# EAGLE design MFOS Dual VCA 2Layer (EAGLE 7.6.0)
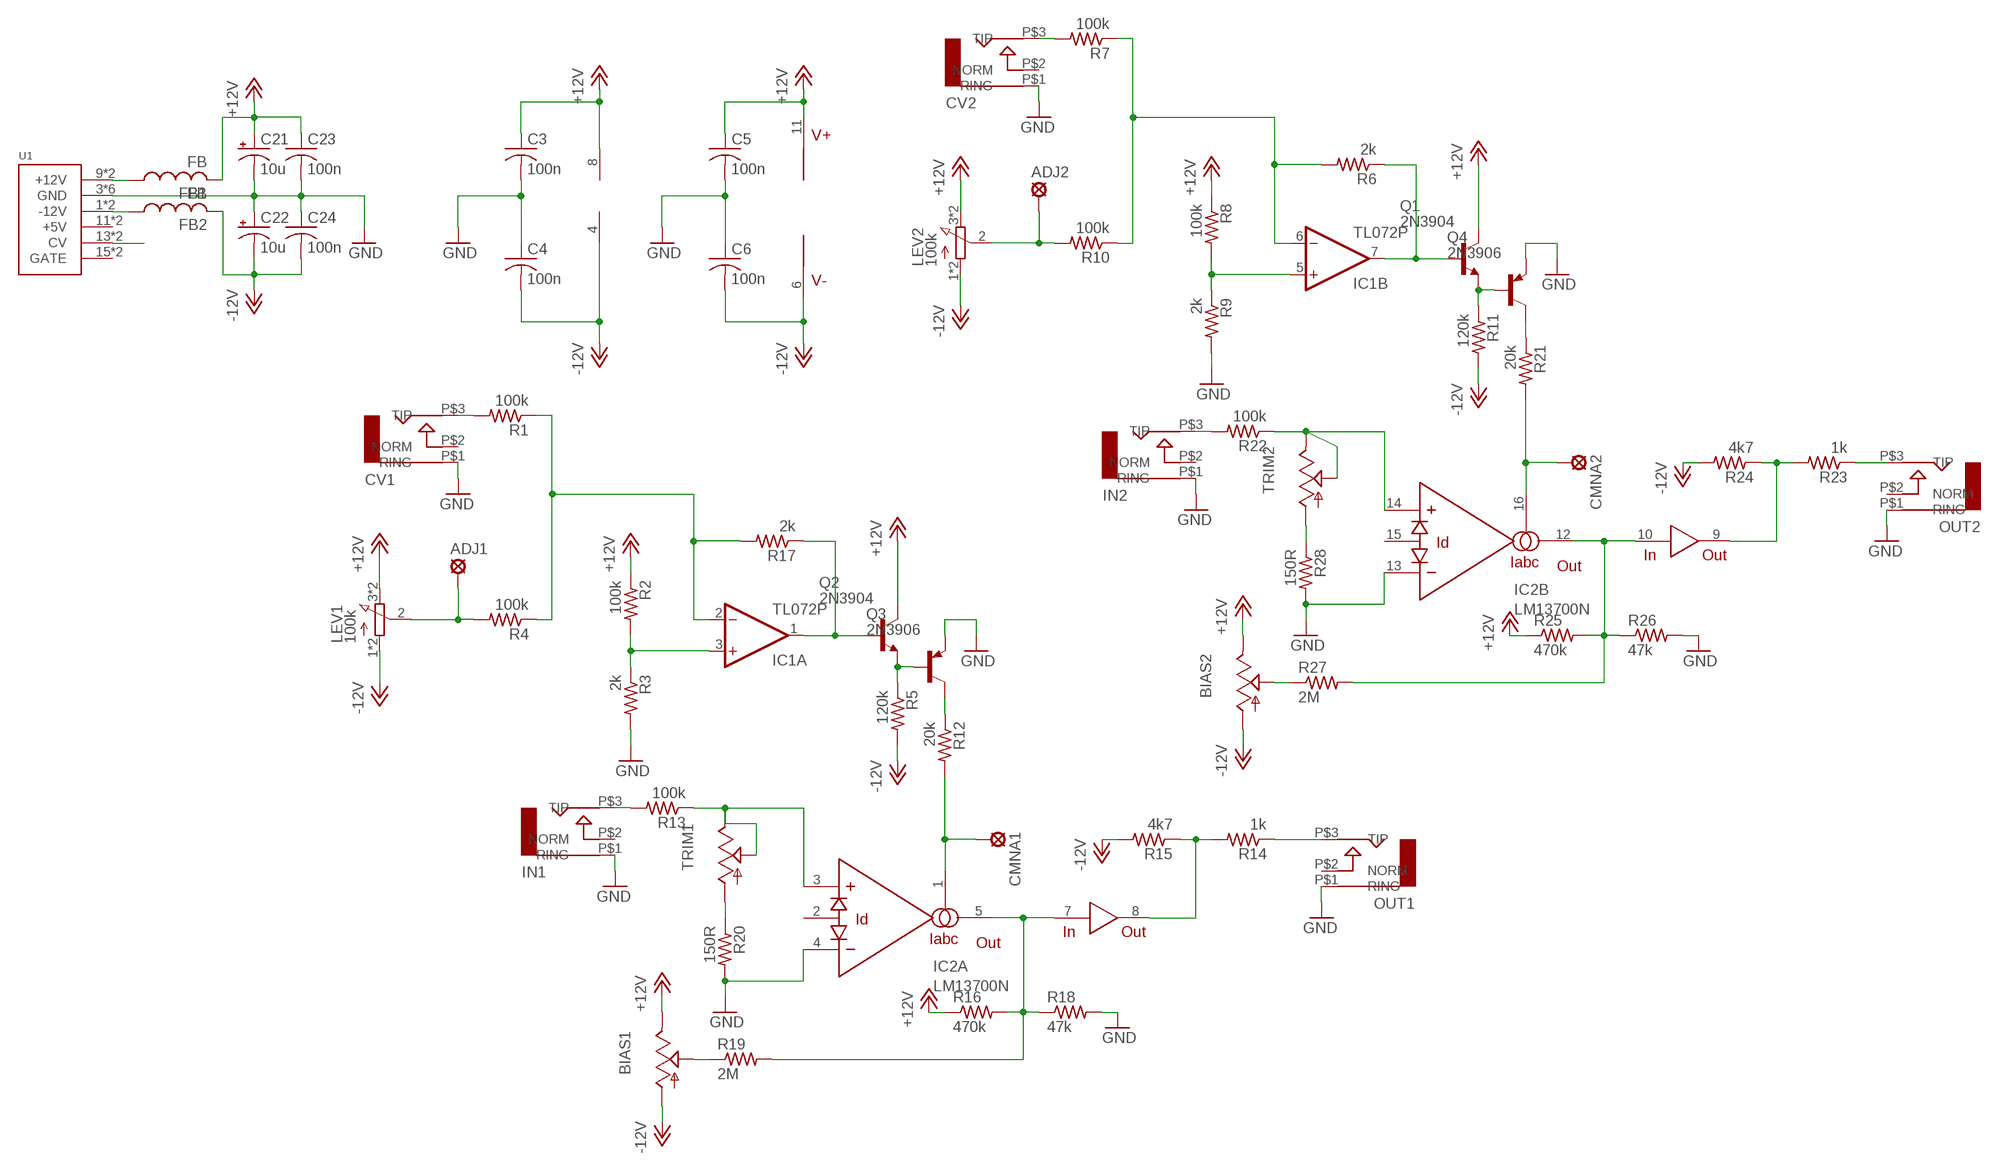
[diagram p0: schematic, sheet 1]

## Parts
ADJ1  LSP10  [LSP10]
ADJ2  LSP10  [LSP10]
BIAS1  TRIM_US-B64W  [B64W]
BIAS2  TRIM_US-B64W  [B64W]
C3  100n  C-USC1206  [C1206]
C4  100n  C-USC1206  [C1206]
C5  100n  C-USC1206  [C1206]
C6  100n  C-USC1206  [C1206]
C21  10u  CPOL-USB45181A  [B45181A]
C22  10u  CPOL-USB45181A  [B45181A]
C23  100n  C-US050-024X044  [C050-024X044]
C24  100n  C-US050-024X044  [C050-024X044]
CMNA1  LSP10  [LSP10]
CMNA2  LSP10  [LSP10]
CV1  AUDIO-JACKITEAD  [JACK-90DEG-ITEAD]
CV2  AUDIO-JACKITEAD  [JACK-90DEG-ITEAD]
FB1  FB  [FB]
FB2  FB  [FB]
IC1  TL072P  [DIL08]
IC2  LM13700N  [DIL16]
IN1  AUDIO-JACKITEAD  [JACK-90DEG-ITEAD]
IN2  AUDIO-JACKITEAD  [JACK-90DEG-ITEAD]
LEV1  100k  3RP/1610N  [3RP/1610N]
LEV2  100k  3RP/1610N  [3RP/1610N]
OUT1  AUDIO-JACKITEAD  [JACK-90DEG-ITEAD]
OUT2  AUDIO-JACKITEAD  [JACK-90DEG-ITEAD]
Q1  2N3904  [TO92]
Q2  2N3904  [TO92]
Q3  2N3906  [TO92]
Q4  2N3906  [TO92]
R1  100k  R-US_0207/7  [0207/7]
R2  100k  R-US_0207/7  [0207/7]
R3  2k  R-US_0207/7  [0207/7]
R4  100k  R-US_0207/7  [0207/7]
R5  120k  R-US_0207/7  [0207/7]
R6  2k  R-US_0207/7  [0207/7]
R7  100k  R-US_0207/7  [0207/7]
R8  100k  R-US_0207/7  [0207/7]
R9  2k  R-US_0207/7  [0207/7]
R10  100k  R-US_0207/7  [0207/7]
R11  120k  R-US_0207/7  [0207/7]
R12  20k  R-US_0207/7  [0207/7]
R13  100k  R-US_0207/7  [0207/7]
R14  1k  R-US_0207/7  [0207/7]
R15  4k7  R-US_0207/7  [0207/7]
R16  470k  R-US_0207/7  [0207/7]
R17  2k  R-US_0207/7  [0207/7]
R18  47k  R-US_0207/7  [0207/7]
R19  2M  R-US_0207/7  [0207/7]
R20  150R  R-US_0207/7  [0207/7]
R21  20k  R-US_0207/7  [0207/7]
R22  100k  R-US_0207/7  [0207/7]
R23  1k  R-US_0207/7  [0207/7]
R24  4k7  R-US_0207/7  [0207/7]
R25  470k  R-US_0207/7  [0207/7]
R26  47k  R-US_0207/7  [0207/7]
R27  2M  R-US_0207/7  [0207/7]
R28  150R  R-US_0207/7  [0207/7]
TRIM1  TRIM_US-B64W  [B64W]
TRIM2  TRIM_US-B64W  [B64W]
U1  POWER  [POWER_16]

## Nets
+12V: BIAS1.E BIAS2.E C3.1 C5.1 C21.+ C23.1 FB1.P$2 IC1.8(P:V+) IC2.11(V+) LEV1.3(E) LEV1.6(E) LEV2.3(E) LEV2.6(E) Q1.1(C) Q2.1(C) R2.1 R8.1 R16.1 R25.1
-12V: BIAS1.A BIAS2.A C4.2 C6.2 C22.- C24.2 FB2.P$2 IC1.4(P:V-) IC2.6(V-) LEV1.1(A) LEV1.4(A) LEV2.1(A) LEV2.4(A) R5.2 R11.2 R15.2 R24.2
GND: C3.2 C4.1 C5.2 C6.1 C21.- C22.+ C23.2 C24.1 CV1.P$1(RING) CV2.P$1(RING) IC2.4(A:-IN) IC2.13(B:-IN) IN1.P$1(RING) IN2.P$1(RING) OUT1.P$1(RING) OUT2.P$1(RING) Q3.3(E) Q4.3(E) R3.2 R9.2 R18.2 R20.2 R26.2 R28.2 U1.3(GND) U1.4(GND) U1.5(GND) U1.6(GND) U1.7(GND) U1.8(GND)
N$1: IC1.7(B:OUT) Q1.2(B) R6.1
N$2: IC1.5(B:+IN) R8.2 R9.1
N$3: CV1.P$3(TIP) R1.2
N$4: CV2.P$3(TIP) R7.2
N$5: ADJ1.MP LEV1.2(S) R4.2
N$6: IC1.2(A:-IN) R1.1 R4.1 R17.2
N$7: Q2.3(E) Q3.2(B) R5.1
N$8: IC1.1(A:OUT) Q2.2(B) R17.1
N$9: ADJ2.MP LEV2.2(S) R10.2
N$10: IC1.6(B:-IN) R6.2 R7.1 R10.1
N$11: IC1.3(A:+IN) R2.2 R3.1
N$12: Q3.1(C) R12.1
N$13: IN1.P$3(TIP) R13.2
N$14: Q1.3(E) Q4.2(B) R11.1
N$15: Q4.1(C) R21.1
N$16: CMNA1.MP IC2.1(A:IABC) R12.2
N$17: IN2.P$3(TIP) R22.2
N$18: BIAS1.P$1(S) BIAS1.S R19.1
N$19: OUT1.P$3(TIP) R14.1
N$20: IC2.8(OUT) R14.2 R15.1
N$21: IC2.5(A:OUT) IC2.7(IN) R16.2 R18.1 R19.2
N$22: R20.1 TRIM1.A
N$23: IC2.3(A:+IN) R13.1 TRIM1.E TRIM1.P$1(S) TRIM1.S
N$24: CMNA2.MP IC2.16(B:IABC) R21.2
N$25: IC2.9(OUT) R23.2 R24.1
N$26: OUT2.P$3(TIP) R23.1
N$27: IC2.10(IN) IC2.12(B:OUT) R25.2 R26.1 R27.2
N$28: BIAS2.P$1(S) BIAS2.S R27.1
N$29: R28.1 TRIM2.A
N$30: IC2.14(B:+IN) R22.1 TRIM2.E TRIM2.P$1(S) TRIM2.S
N$55: U1.13(CV) U1.14(CV)
N$61: FB1.P$1 U1.9(+12V) U1.10(+12V)
N$62: FB2.P$1 U1.1(-12V) U1.2(-12V)
Unconnected: CV1.P$2(NORM) CV2.P$2(NORM) IC2.2(A:ID) IC2.15(B:ID) IN1.P$2(NORM) IN2.P$2(NORM) OUT1.P$2(NORM) OUT2.P$2(NORM) U1.11(+5V) U1.12(+5V) U1.15(GATE) U1.16(GATE)

## Library data of the parts
ADJ1 ADJ2 CMNA1 CMNA2 = solpad:LSP10: SOLDER PAD drill 1.0 mm, distributor Buerklin, 12H555
BIAS1 BIAS2 TRIM1 TRIM2 = pot:TRIM_US-: POTENTIOMETER
C3-C6 C23 C24 = rcl:C-US: CAPACITOR, American symbol
C21 C22 = rcl:CPOL-US: POLARIZED CAPACITOR, American symbol
CV1 CV2 IN1 IN2 OUT1 OUT2 = erthenvar:AUDIO-JACK: Switching Mono 3.5mm Audio Jack from Erthenvar.
FB1 FB2 = adafruit:FB: Ferrite bead Digikey #P9821BK-ND
IC1 = linear:TL072: OP AMP
IC2 = synthdiy updated imperial:LM13700: National Dual OTA with buffers.
LEV1 LEV2 = pot:3RP/1610N: 16mm Potentiometer one level Source: http://www.alphapotentiometers.net/html/16mm_pot_2.html
Q1 Q2 = transistor-npn:2N3904: NPN Transistor
Q3 Q4 = transistor-pnp:2N3906: PNP Transistor
R1-R28 = rcl:R-US_: RESISTOR, American symbol
U1 = eurorack:POWER

## Board
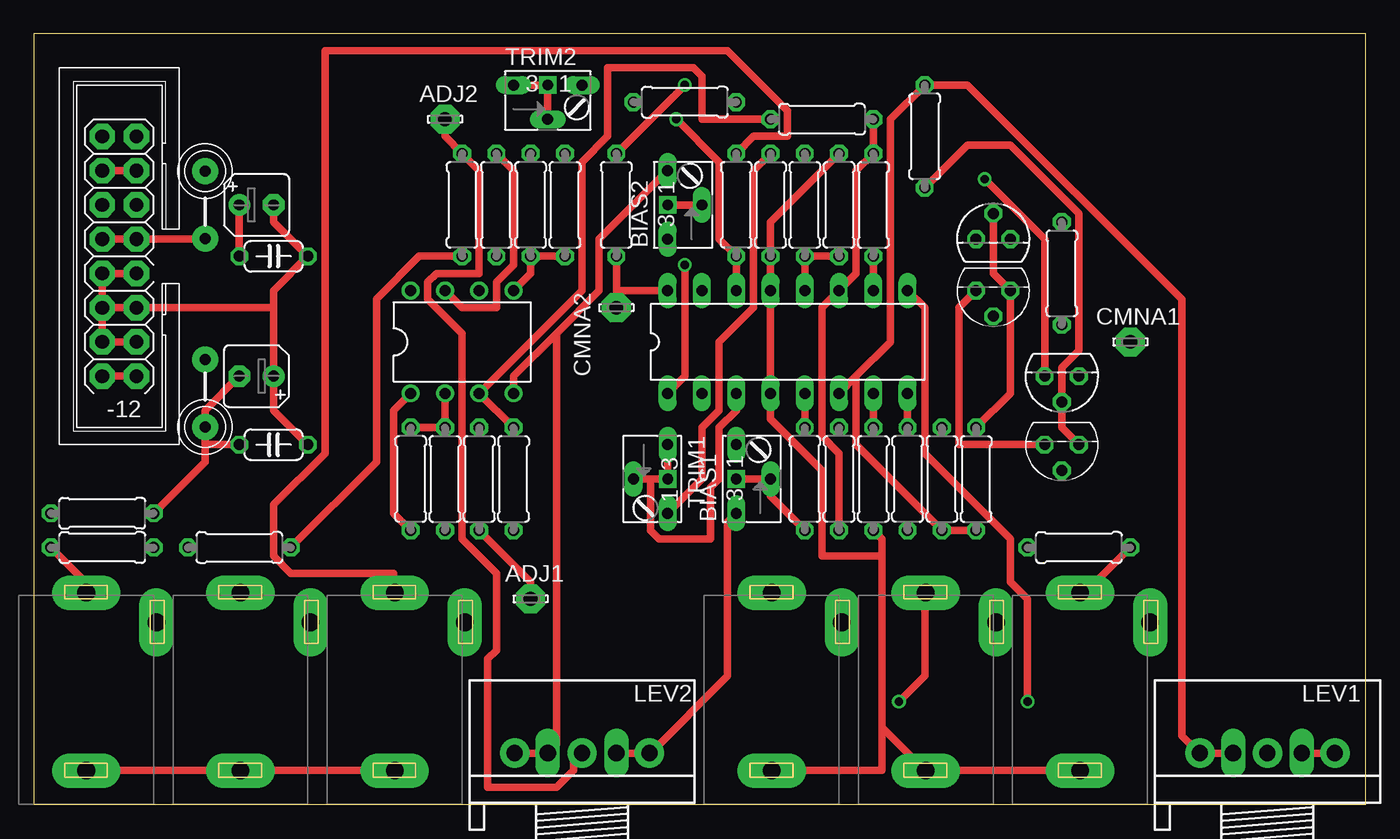
[diagram p1: board, top side]
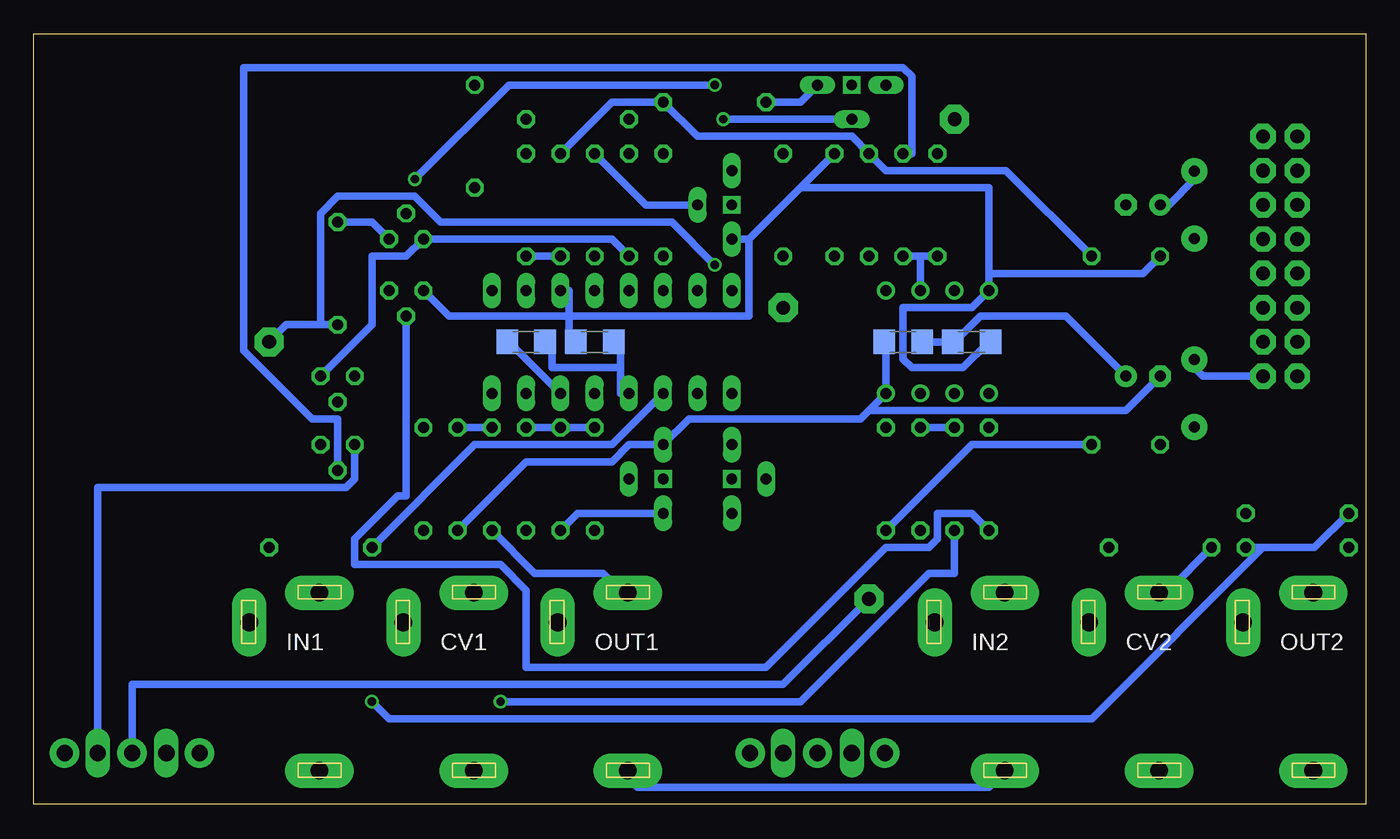
[diagram p2: board, bottom side, seen from below]

Size 98.73 x 57.14 mm. Coordinates in mm from the lower left corner, seen from the top.
Outline: 0,0 98.73,0 98.73,57.14 0,57.14 0,0
Copper layers (1*16): Top 0.035mm / dielectric 1.5mm / Bottom 0.035mm
Design rules "default *": minimum track width 22mil, minimum drill 24mil, track to track 12mil, track to pad 12mil, pad to pad 12mil, via to via 12mil, smd to smd 12mil, copper to edge 0mil, drill to drill 12mil, minimum pad ring 10mil, minimum via ring 8mil, stop-mask expansion 4mil, vias tented up to drill 0mil, thermal gap 10mil

### Footprints (pad centres in the part's own frame; a part is rotated, then mirrored left to right if it is on the bottom)
LSP10 = drill 1.016 pad 2.159 octagon: MP 0,0
B64W = drill 0.813 long: A 2.54,0; E -2.54,0; S 0,-2.54 | drill 0.8 square: P$1 0,0
C1206 = smd 1.6 x 1.8: 1 -1.4,0; 2 1.4,0
B45181A = drill 0.813 pad 1.6: + -1.27,0 | drill 0.813 pad 1.6 octagon: - 1.27,0
C050-024X044 = drill 0.813 octagon: 1 -2.54,0; 2 2.54,0
JACK-90DEG-ITEAD = drill 1.3 pad 2.54 long: P$1 5,-2.5; P$2 -0.2,-13.5; P$3 5,-15.7
FB = drill 0.8 pad 1.93: P$1 -2.5,0; P$2 2.5,0
DIL08 = drill 0.813 pad 1.27: 1 -3.81,-3.81; 2 -1.27,-3.81; 3 1.27,-3.81; 4 3.81,-3.81; 5 3.81,3.81; 6 1.27,3.81; 7 -1.27,3.81; 8 -3.81,3.81
DIL16 = drill 0.813 long: 1 -8.89,-3.81; 2 -6.35,-3.81; 3 -3.81,-3.81; 4 -1.27,-3.81; 5 1.27,-3.81; 6 3.81,-3.81; 7 6.35,-3.81; 8 8.89,-3.81; 9 8.89,3.81; 10 6.35,3.81; 11 3.81,3.81; 12 1.27,3.81; 13 -1.27,3.81; 14 -3.81,3.81; 15 -6.35,3.81; 16 -8.89,3.81
3RP/1610N = drill 1.2 pad 2.184: 1 -5,0; 2 0,0; 3 5,0 | drill 1.2 long: 4 -2.54,0; 6 2.54,0
TO92 = drill 0.813 octagon: 1 1.27,0; 2 0,1.905; 3 -1.27,0
0207/7 = drill 0.813 octagon: 1 -3.81,0; 2 3.81,0
POWER_16 = drill 1.016 pad 1.88 octagon: 1 -6.35,-1.27; 2 -6.35,1.27; 3 -3.81,-1.27; 4 -3.81,1.27; 5 -1.27,-1.27; 6 -1.27,1.27; 7 1.27,-1.27; 8 1.27,1.27; 9 3.81,-1.27; 10 3.81,1.27; 11 6.35,-1.27; 12 6.35,1.27; 13 8.89,-1.27; 14 8.89,1.27; 15 11.43,-1.27; 16 11.43,1.27

### Placement (x,y rotation side)
ADJ1  36.83,15.24 0 top
ADJ2  30.48,50.8 0 top
BIAS1  52.07,24.13 90 top
BIAS2  46.99,44.45 90 top
C3  29.21,34.29 180 bottom
C4  34.29,34.29 180 bottom
C5  57.15,34.29 0 bottom
C6  62.23,34.29 180 bottom
C21  16.51,44.45 0 top
C22  16.51,31.75 180 top
C23  17.78,40.64 0 top
C24  17.78,26.67 180 top
CMNA1  81.28,34.29 0 top
CMNA2  43.18,36.83 0 top
CV1  71.12,0 180 top
CV2  20.32,0 180 top
FB1  12.7,44.45 90 top
FB2  12.7,30.48 270 top
IC1  31.75,34.29 0 top
IC2  55.88,34.29 0 top
IN1  82.55,0 180 top
IN2  31.75,0 180 top
LEV1  91.44,3.81 0 top
LEV2  40.64,3.81 0 top
OUT1  59.69,0 180 top
OUT2  8.89,0 180 top
Q1  76.2,26.67 180 top
Q2  71.12,38.1 180 top
Q3  71.12,41.91 0 top
Q4  76.2,31.75 180 top
R1  30.48,24.13 270 top
R2  58.42,50.8 180 top
R3  35.56,24.13 270 top
R4  33.02,24.13 270 top
R5  69.85,24.13 270 top
R6  34.29,44.45 270 top
R7  15.24,19.05 180 top
R8  39.37,44.45 270 top
R9  36.83,44.45 90 top
R10  31.75,44.45 90 top
R11  66.04,49.53 90 top
R12  76.2,39.37 270 top
R13  77.47,19.05 0 top
R14  64.77,24.13 90 top
R15  67.31,24.13 270 top
R16  59.69,24.13 90 top
R17  27.94,24.13 90 top
R18  62.23,24.13 270 top
R19  57.15,24.13 90 top
R20  54.61,44.45 270 top
R21  43.18,44.45 270 top
R22  52.07,44.45 90 top
R23  5.08,19.05 0 top
R24  5.08,21.59 0 top
R25  62.23,44.45 270 top
R26  59.69,44.45 90 top
R27  57.15,44.45 270 top
R28  48.26,52.07 0 top
TRIM1  46.99,24.13 270 top
TRIM2  38.1,53.34 0 top
U1  6.35,38.1 90 top

### Tracks (layer width: path | path; a pad name or v marks a point on that pad's centre or on a via)
+12V
  Top 0.559: C21.+ C23.1 | LEV2.6 LEV2.3 45.72,3.81 51.44,9.53 51.44,20.95 BIAS1.E | LEV1.3 LEV1.6 | R2.1 R25.1 60.96,46.99 60.96,39.37 IC2.11 58.42,36.83 58.42,27.3 59.69,26.04 R16.1 | Q1.1 68.58,26.67 68.58,36.83 Q2.1
  Bottom 0.559: C21.+ 14.61,44.45 12.7,46.35 FB1.P$2 | C3.1 27.94,34.29 29.84,32.38 33.66,32.38 34.29,33.02 34.29,36.83 29.21,36.83 IC1.8 27.94,39.37 | 45.72,41.91 41.91,45.72 | 41.91,45.72 R8.1 | BIAS2.E 45.72,41.91 | 27.94,39.37 27.94,45.72 41.91,45.72 | C23.1 16.51,39.37 27.94,39.37 | BIAS1.E 58.42,21.59 R16.1 | 59.05,36.2 59.05,38.1 IC2.11 | 59.05,36.2 59.05,34.29 C5.1 | Q2.1 67.94,36.2 59.05,36.2 | LEV1.6 93.98,23.5 75.56,23.5 74.93,24.13 Q1.1 | 45.72,41.91 45.72,36.2 59.05,36.2
-12V
  Top 0.559: LEV1.4 LEV1.1 86.36,3.81 85.09,5.08 85.09,37.47 69.22,53.34 R11.2 63.5,50.8 63.5,34.29 60.96,31.75 | R5.2 R15.2 60.96,26.67 60.96,31.75 | IC2.6 60.96,31.75 | R24.2 12.7,25.4 12.7,26.67 | 12.7,26.67 FB2.P$2 12.7,29.21 C22.- | 12.7,26.67 C24.2 | LEV2.1 LEV2.4 38.73,4.45 38.73,34.92 | BIAS2.A 41.91,41.91 41.91,38.1 38.73,34.92 | 38.73,34.92 35.56,31.75 IC1.4
  Bottom 0.559: IC2.6 63.5,34.29 C6.2 | C4.2 35.56,34.29 IC1.4 36.83,29.21 | 36.83,29.21 37.47,28.57 50.16,28.57 BIAS1.A 54.61,26.67 55.88,25.4 62.23,25.4 R15.2 | C22.- 17.78,29.21 36.83,29.21
GND
  Top 0.559: OUT2.P$1 4.45,2.54 15.24,2.54 CV2.P$1 15.88,2.54 26.67,2.54 IN2.P$1 | R18.2 62.87,19.68 62.87,18.41 | 62.87,5.71 62.87,18.41 | 62.87,5.71 66.04,2.54 CV1.P$1 66.67,2.54 77.47,2.54 IN1.P$1 | 62.87,5.71 62.87,2.54 55.24,2.54 OUT1.P$1 | U1.7 U1.8 U1.6 | U1.6 U1.4 U1.3 | U1.6 U1.5 17.78,36.83 | C21.- 17.78,43.18 C23.2 17.78,38.1 17.78,36.83 | C24.1 17.78,29.21 C22.+ 17.78,36.83 | R26.2 54.61,43.18 R20.2 IC2.13 IC2.4 54.61,28.57 58.42,24.77 58.42,18.41 62.87,18.41
  Bottom 0.559: IN2.P$1 27.3,1.91 27.94,1.27 53.98,1.27 54.61,1.91 OUT1.P$1 | C4.1 C3.2 30.48,34.29 28.57,36.2 22.23,36.2 C22.+ | R3.2 29.21,26.67 C24.1 | R26.2 55.88,52.07 R28.2 49.53,49.53 38.1,49.53 R9.2 35.56,46.99 26.67,46.99 C23.2 | 55.24,32.38 55.24,30.48 IC2.4 | 55.24,32.38 55.24,34.29 C5.2 | 55.24,32.38 60.33,32.38 60.33,34.29 C6.1 | R20.2 55.88,41.91 Q3.3 71.12,40.64 73.66,40.64 73.66,35.56 Q4.3
N$1
  Top 0.559: IC1.7 31.75,36.83 34.29,36.83 34.29,38.73 35.56,40.01 35.56,46.99 R6.1
  Bottom 0.559: Q1.2 76.2,28.57 78.11,28.57 83.19,33.66 83.19,54.61 34.29,54.61 33.66,53.98 33.66,48.26 R6.1
N$2
  Top 0.559: IC1.5 36.83,39.37 R9.1 R8.2
N$3  (via drill 0.61)
  Top 0.559: v64.14,7.62 66.04,9.53 66.04,15.24 CV1.P$3
  Bottom 0.559: R1.2 30.48,17.14 32.38,17.14 41.91,7.62 v64.14,7.62
N$4
  Bottom 0.559: R7.2 14.61,15.88 15.24,15.88 CV2.P$3
N$5
  Top 0.559: R4.2 36.83,16.51 ADJ1.MP
  Bottom 0.559: LEV1.2 91.44,8.89 43.18,8.89 ADJ1.MP
N$6
  Top 0.559: R17.2 R1.1 IC1.2
  Bottom 0.559: R1.1 R4.1
N$7
  Top 0.559: R5.1 72.39,30.48 Q2.3 71.12,39.37 Q3.2
N$8
  Top 0.559: R17.1 26.67,21.59 26.67,29.21 IC1.1
  Bottom 0.559: Q2.2 71.12,22.86 71.75,22.86 74.93,19.68 74.93,17.78 64.14,17.78 62.23,15.88 62.23,10.16 44.45,10.16 35.56,19.05 32.38,19.05 31.75,19.68 31.75,21.59 29.21,21.59 R17.1
N$9
  Top 0.559: ADJ2.MP 30.48,49.53 R10.2 33.02,46.99 33.02,39.37 29.84,39.37 29.21,38.73 29.21,37.47 31.75,34.92 31.75,19.68 34.29,17.14 34.29,11.43 33.66,10.79 33.66,1.27 38.73,1.27 40.01,2.54 40.01,3.17 LEV2.2
N$10
  Top 0.559: R7.1 25.4,25.4 25.4,37.47 28.57,40.64 R10.1
  Bottom 0.559: 33.02,40.64 IC1.6 | R10.1 33.02,40.64 | 33.02,40.64 R6.2
N$11
  Top 0.559: R3.1 IC1.3 40.64,38.1 40.64,47.62 42.55,49.53 42.55,54.61 48.9,54.61 49.53,53.98 49.53,50.8 R2.2
N$12
  Bottom 0.559: Q3.1 73.66,43.18 R12.1
N$13
  Top 0.559: R13.2 78.11,15.88 IN1.P$3
N$14
  Top 0.559: Q1.3 76.2,27.94 Q4.2 76.2,32.38 77.47,33.66 77.47,43.81 72.39,48.9 69.22,48.9 R11.1
N$15  (via drill 0.61)
  Top 0.559: v48.26,53.34 R21.1 | v70.48,46.35 74.93,41.91 Q4.1
  Bottom 0.559: v48.26,53.34 63.5,53.34 v70.48,46.35
N$16  (via drill 0.61)
  Top 0.559: IC2.1 48.26,31.75 v48.26,40.01
  Bottom 0.559: v48.26,40.01 51.44,43.18 68.58,43.18 70.48,45.09 76.2,45.09 77.47,43.81 77.47,35.56 | R12.2 77.47,35.56 | CMNA1.MP 80.01,35.56 77.47,35.56
N$17
  Top 0.559: R22.2 53.34,49.53 55.88,49.53 55.88,51.44 51.44,55.88 21.59,55.88 21.59,26.04 17.78,22.23 17.78,18.41 19.05,17.14 26.67,17.14 26.67,15.88 IN2.P$3
N$18
  Top 0.559: BIAS1.P$1 BIAS1.S 54.61,22.86 R19.1
N$19
  Bottom 0.559: R14.1 61.59,17.14 56.52,17.14 55.24,15.88 OUT1.P$3
N$20
  Top 0.559: IC2.8 R14.2
  Bottom 0.559: R14.2 R15.1
N$21
  Top 0.559: IC2.7 R18.1 | IC2.5 R19.2
  Bottom 0.559: R19.2 R16.2 R18.1
N$22
  Top 0.559: TRIM1.A 49.53,24.13 49.53,27.94 50.8,29.21 50.8,34.29 53.34,36.83 53.34,46.99 R20.1
N$23
  Top 0.559: TRIM1.S 45.72,24.13 | 45.72,24.13 TRIM1.P$1 TRIM1.E | 45.72,24.13 45.72,20.32 46.35,19.68 50.16,19.68 50.16,23.5 50.8,24.13 50.8,27.94 52.07,29.21 IC2.3
  Bottom 0.559: IC2.3 55.88,26.67 66.04,26.67 R13.1
N$24
  Top 0.559: CMNA2.MP 43.18,38.1 | 43.18,38.1 R21.2 | 43.18,38.1 IC2.16
N$25  (via drill 0.61)
  Top 0.559: IC2.9 66.04,36.83 66.04,26.04 72.39,19.68 72.39,16.51 73.66,15.24 v73.66,7.62
  Bottom 0.559: R24.1 3.81,19.05 7.62,19.05 | R23.2 7.62,19.05 | v73.66,7.62 72.39,6.35 20.32,6.35 7.62,19.05
N$26
  Top 0.559: R23.1 3.81,16.51 3.81,15.88 OUT2.P$3
N$27
  Top 0.559: R25.2 IC2.10 | IC2.12 R27.2 R26.1
  Bottom 0.559: R26.1 R25.2
N$28
  Top 0.559: BIAS2.S BIAS2.P$1
  Bottom 0.559: R27.1 53.34,44.45 BIAS2.S
N$29
  Bottom 0.559: TRIM2.A 41.91,52.07 R28.1
N$30  (via drill 0.61)
  Top 0.559: IC2.14 R22.1 50.8,41.91 50.8,47.62 v47.62,50.8 | TRIM2.E TRIM2.P$1 TRIM2.S
  Bottom 0.559: TRIM2.S v47.62,50.8
N$55
  Top 0.559: U1.13 U1.14
N$61
  Top 0.559: U1.10 U1.9 12.7,41.91 FB1.P$1
N$62
  Top 0.559: U1.1 U1.2
  Bottom 0.559: U1.1 12.06,31.75 12.7,32.38 FB2.P$1